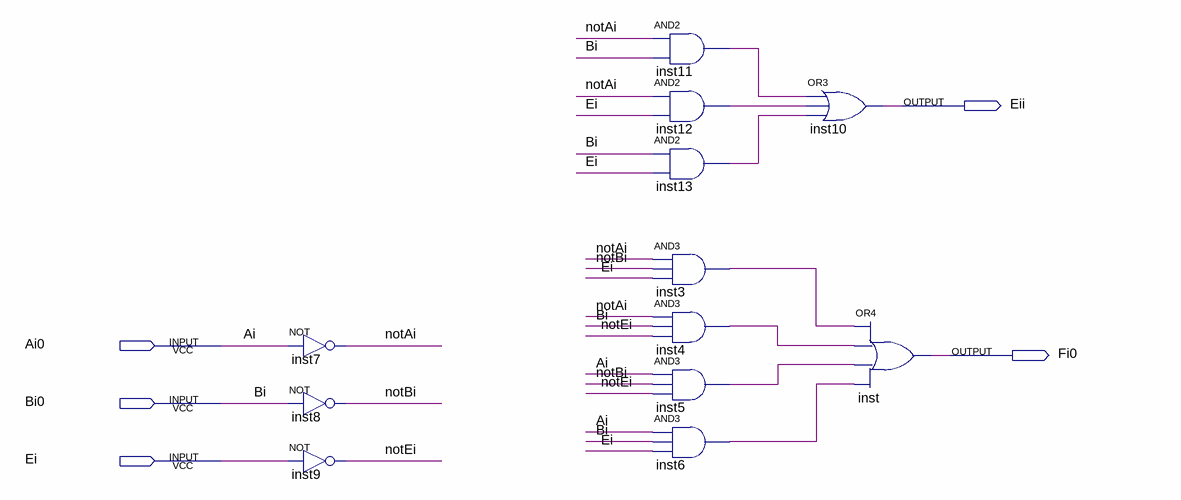
[diagram p0: schematic sheet]
// Quartus schematic SUB1.bdf as structural Verilog: 12 symbols, 5 pins
module SUB1 (
  input  Ai0,
  input  Bi0,
  input  Ei,
  output Eii,
  output Fi0
);

  wire inst3_out, inst4_out, inst5_out, inst6_out, inst11_out, inst12_out, inst13_out, notAi, notBi, notEi;

  not inst7 (notAi, Ai0);
  not inst8 (notBi, Bi0);
  not inst9 (notEi, Ei);
  and inst11 (inst11_out, notAi, Bi0);
  and inst12 (inst12_out, notAi, Ei);
  and inst13 (inst13_out, Bi0, Ei);
  and inst3 (inst3_out, notAi, notBi, Ei);
  and inst4 (inst4_out, notAi, Bi0, notEi);
  and inst5 (inst5_out, Ai0, notBi, notEi);
  and inst6 (inst6_out, Ai0, Bi0, Ei);
  or inst10 (Eii, inst11_out, inst12_out, inst13_out);
  or inst (Fi0, inst3_out, inst4_out, inst5_out, inst6_out);

  // Other names for the same wires on the sheet: Ai = Ai0; Bi = Bi0
endmodule
